# Altium schematic sheet Reed_Switch.SchDoc
size A4; SheetNumber: 5
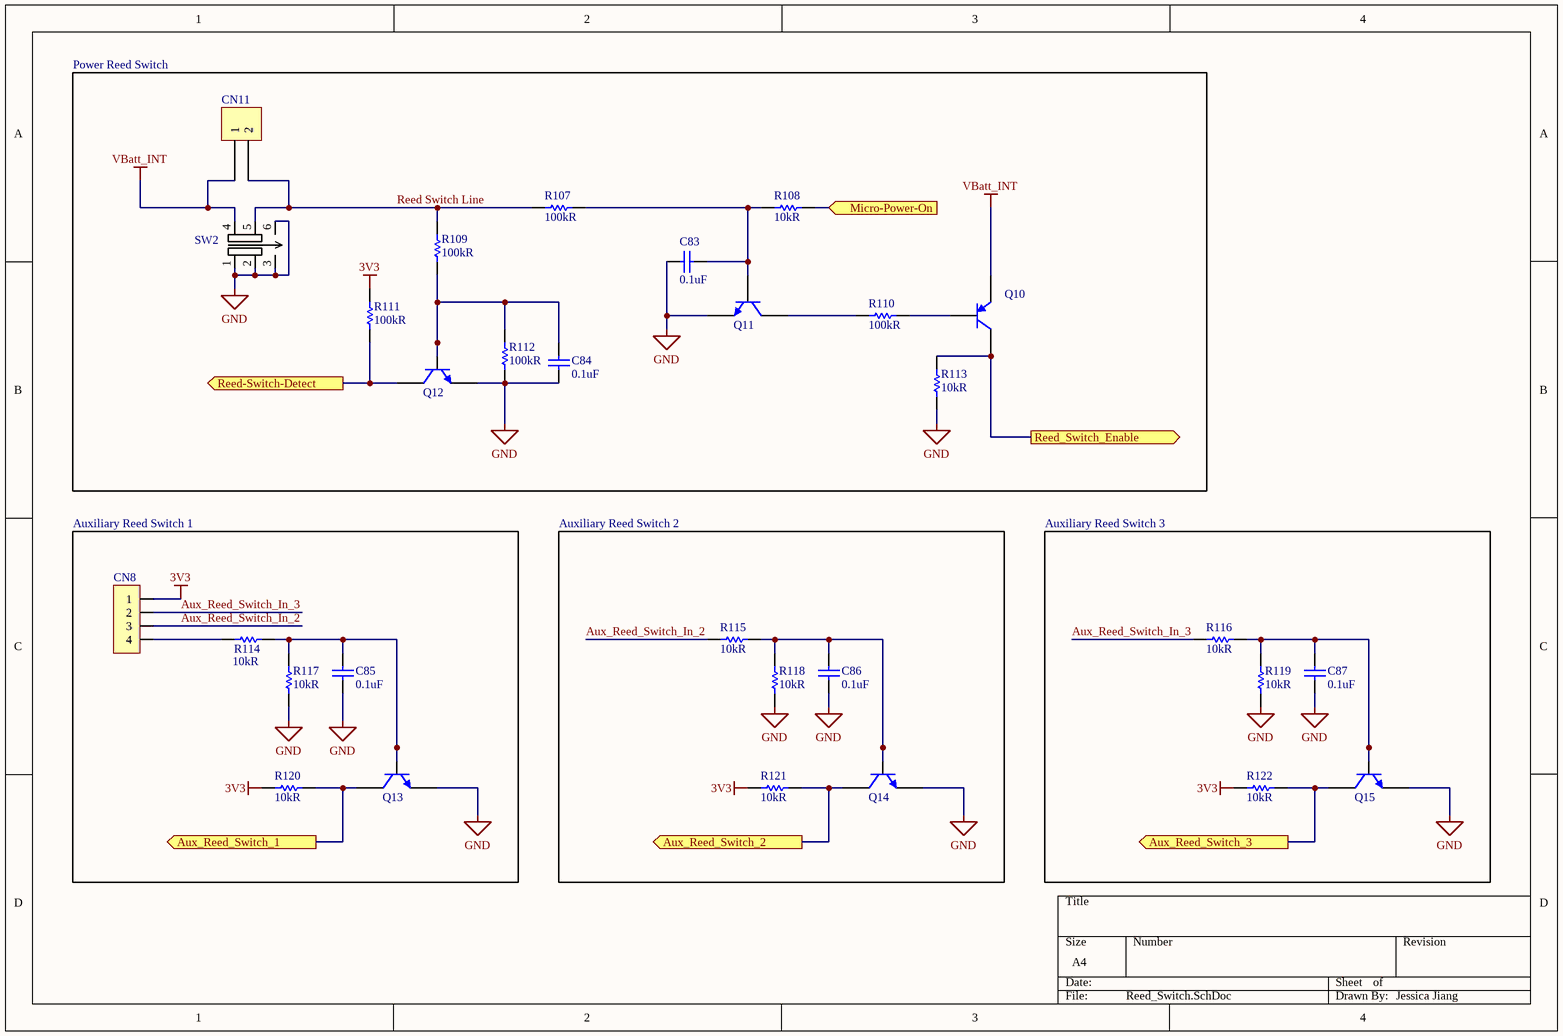
[diagram p0: Reed_Switch.SchDoc]

## Parts
C83  Capacitance: 0.1uF  [FP-CL10-0_1-IPC_A]  (hidden comment: CL10B104JB8NNNC)
C84  Capacitance: 0.1uF  [FP-CL10-0_1-IPC_A]  (hidden comment: CL10B104JB8NNNC)
C85  Capacitance: 0.1uF  [FP-CL10-0_1-IPC_A]  (hidden comment: CL10B104JB8NNNC)
C86  Capacitance: 0.1uF  [FP-CL10-0_1-IPC_A]  (hidden comment: CL10B104JB8NNNC)
C87  Capacitance: 0.1uF  [FP-CL10-0_1-IPC_A]  (hidden comment: CL10B104JB8NNNC)
CN8  Header, Male, 1x4, RA, Pitch 0.1" (2.54mm)  [HEADER, MALE, SHROUDED, 4x1, PITCH 0.1" (2.54mm), RA]  (value not drawn)
CN11  1x2 Shrouded Right Angle  [2X1 Female Header]  (value not drawn)
Q10  BC856A,215  [SOT-23]  (value not drawn)
Q11  BC846B,215  [SOT-23]  (value not drawn)
Q12  BC846B,215  [SOT-23]  (value not drawn)
Q13  BC846B,215  [SOT-23]  (value not drawn)
Q14  BC846B,215  [SOT-23]  (value not drawn)
Q15  BC846B,215  [SOT-23]  (value not drawn)
R107  Resistance: 100kR  [RESC1609X50X30ML10T20]  (hidden comment: CRCW0603-100KFKEA)
R108  Resistance: 10kR  [RESC1608X55X25ML10T15]  (hidden comment: RC0603FR-0710KL)
R109  Resistance: 100kR  [RESC1609X50X30ML10T20]  (hidden comment: CRCW0603-100KFKEA)
R110  Resistance: 100kR  [RESC1609X50X30ML10T20]  (hidden comment: CRCW0603-100KFKEA)
R111  Resistance: 100kR  [RESC1609X50X30ML10T20]  (hidden comment: CRCW0603-100KFKEA)
R112  Resistance: 100kR  [RESC1609X50X30ML10T20]  (hidden comment: CRCW0603-100KFKEA)
R113  Resistance: 10kR  [RESC1608X55X25ML10T15]  (hidden comment: RC0603FR-0710KL)
R114  Resistance: 10kR  [RESC1608X55X25ML10T15]  (hidden comment: RC0603FR-0710KL)
R115  Resistance: 10kR  [RESC1608X55X25ML10T15]  (hidden comment: RC0603FR-0710KL)
R116  Resistance: 10kR  [RESC1608X55X25ML10T15]  (hidden comment: RC0603FR-0710KL)
R117  Resistance: 10kR  [RESC1608X55X25ML10T15]  (hidden comment: RC0603FR-0710KL)
R118  Resistance: 10kR  [RESC1608X55X25ML10T15]  (hidden comment: RC0603FR-0710KL)
R119  Resistance: 10kR  [RESC1608X55X25ML10T15]  (hidden comment: RC0603FR-0710KL)
R120  Resistance: 10kR  [RESC1608X55X25ML10T15]  (hidden comment: RC0603FR-0710KL)
R121  Resistance: 10kR  [RESC1608X55X25ML10T15]  (hidden comment: RC0603FR-0710KL)
R122  Resistance: 10kR  [RESC1608X55X25ML10T15]  (hidden comment: RC0603FR-0710KL)
SW2  DPDT, 12V, 200mA, SMT  [CL-2B-22A]  (value not drawn)

## Blocks framed on the sheet
Power Reed Switch: C83 C84 CN11 Q10-Q12 R107-R113 SW2
Auxiliary Reed Switch 1: C85 CN8 Q13 R114 R117 R120
Auxiliary Reed Switch 2: C86 Q14 R115 R118 R121
Auxiliary Reed Switch 3: C87 Q15 R116 R119 R122

## Ports
Aux_Reed_Switch_1 (out), Aux_Reed_Switch_2 (out), Aux_Reed_Switch_3 (out), Micro-Power-On (in), Reed-Switch-Detect (out), Reed_Switch_Enable (out)

## Nets
3V3: CN8.1 R111.2 R120.2 R121.2 R122.1
GND: C83.2 C84.2 C85.2 C86.2 C87.2 Q11.2(E) Q12.2(E) Q13.2(E) Q14.2(E) Q15.2(E) R112.1 R113.2 R117.1 R118.1 R119.2 SW2.1 SW2.2 SW2.3 SW2.6
VBatt_INT: CN11.1 Q10.2(E) SW2.4
Aux_Reed_Switch_1: Q13.3(C) R120.1 ; port Aux_Reed_Switch_1
Aux_Reed_Switch_2: Q14.3(C) R121.1 ; port Aux_Reed_Switch_2
Aux_Reed_Switch_3: Q15.3(C) R122.2 ; port Aux_Reed_Switch_3
Aux_Reed_Switch_In_2: CN8.3 R115.2
Aux_Reed_Switch_In_3: CN8.2 R116.2
Micro-Power-On: R108.2 ; port Micro-Power-On
Reed Switch Line: CN11.2 R107.2 R109.2 SW2.5
Reed-Switch-Detect: Q12.3(C) R111.1 ; port Reed-Switch-Detect
Reed_Switch_Enable: Q10.3(C) R113.1 ; port Reed_Switch_Enable
NetC83_1: C83.1 Q11.1(B) R107.1 R108.1
NetC84_1: C84.1 Q12.1(B) R109.1 R112.2
NetC85_1: C85.1 Q13.1(B) R114.1 R117.2
NetC86_1: C86.1 Q14.1(B) R115.1 R118.2
NetC87_1: C87.1 Q15.1(B) R116.1 R119.1
NetCN8_4: CN8.4 R114.2
NetQ10_1: Q10.1(B) R110.2
NetQ11_3: Q11.3(C) R110.1

## Notes on the sheet
- Jessica Jiang

## Library data of the parts
C83-C87 = CMP-00000-4: CAP CER 0.1UF 50V X7R 0603; Tolerance: 5%; Material: Ceramic; Case Code (Imperial): 0603; Mount: Surface Mount; Thickness: 0.035inch; Depth: 0.8mm; Packaging: Tape and Reel; Package Quantity: 1; Dielectric: X7R; Height: 0.8mm; Voltage: 50V; Radiation Hardening: No; Max Operating Temperature: 125°C; Voltage Rating: 50V; Case/Package: 0603; Min Operating Temperature: -55°C; Case Code (Metric): 1608; Length: 1.6mm; Contact Plating: Tin; Width: 0.031inch
CN8 = CMP-005-0029-3: Connector Header Through Hole, Right Angle 4 position 0.100" (2.54mm); Source: AUVic_Schematic_Library_Connectors.SchLib; Created On: 2020-05-20; Pin Count: 4; Component Type: Standard; Design Item ID: Header, Male, 1x4, RA, Pitch 0.1" (2.54mm); Created By: Miguel Manguerra
CN11 = CMP-00010-3: 02 MTE HDR SRRA LATCH; PCB Mount Retention: Without; Number of Positions: 2; Row Spacing: 0.1inch; Contact Retention: Yes (With); PCB Mount Alignment: No (Without); Current Rating: 3A; PCB Thickness: 0.062inch; Insulation Resistance: 5GR; Gender: Male; Connector Type: Plug,Header,Pin; Tail Length: 3.3mm; Approvals: CSA; Pitch: 2.54mm; Contact Resistance: 15mR; Color: Black; REACH SVHC: Unknown; Contact Shape: Square; Number of Contacts: 2; PCB Mounting Orientation: Right Angle; Housing Material: Thermoplastic; Max Operating Temperature: 105°C; Mount: Through Hole; Package Quantity: 68; Contact Current Rating: 3A; Housing Color: Black; Contact Material: Brass; Min Operating Temperature: -65°C; Packaging: Rail/Tube; Height: 13.59mm; ELV: Compliant; Number of Rows: 1; Orientation: Right Angle; Lead Free: Lead Free; Mating Retention: Yes (With); Strain Relief: No (Without); Length: 7.62mm; Flammability Rating: UL94 V-0; Contact Plating: Gold,Tin,Matte; Contact Mating Length: 0.23inch; Contact Gender: Male; Termination: Crimp; Backwall/Post Interruptions: No (Without); Depth: 13.59mm; Mating Alignment: Yes (With)
Q10 = CMP-052-0003-1: PNP 65V 100mA 250mW; Published: 8-Jun-2000; LatestRevisionDate: 15-Jan-2003; Component Type: Standard; Pin Count: 3; Source: AUVic_Schematic_Library_Transistors.SchLib; Design Item ID: BC856A,215
Q11-Q15 = CMP-052-0002-1: NPN 65V 100mA 250mW; Published: 8-Jun-2000; LatestRevisionDate: 09-Sep-2016; DatasheetVersion: 1997; Publisher: Andy Bates; Pin Count: 3; Component Type: Standard; Source: AUVic_Schematic_Library_Transistors.SchLib; Design Item ID: BC846B,215
R107 R109-R112 = CMP-00036-2: Resistor; Thick Film; 100 Kilohms; 0.1 W; 1%; SMT; 0603; TCR 37 ppm/DegC; Tape and Reel; Voltage Rating: 75V; Temperature Coefficient: 100ppm/°C; Power Rating: 100mW; Number of Terminations: 2; Number of Pins: 2; Contact Plating: Tin,Lead; Lead Free: Lead Free; Voltage Rating (DC): 75V; Package Quantity: 10; REACH SVHC: Unknown; Min Operating Temperature: -55°C; Height: 0.45mm; Composition: Thick Film; Case Code (Metric): 1608; Weight: 7.1E-05oz; Depth: 0.85mm; Features: Automotive AEC-Q200; Military Standard: Not; Tolerance: 1%; Radiation Hardening: No; Max Power Dissipation: 100mW; Case Code (Imperial): 0603; Max Operating Temperature: 155°C; Packaging: Tape and Reel; Width: 0.033inch; Case/Package: 0603; Termination: SMD/SMT; Length: 1.55mm
R108 R113-R122 = CMP-00037-2: Res General Purpose Thick Film 0603 10K Ohm 1% 1/10W ±100ppm/°C Molded SMD Paper T/R; Power Rating: 100mW; Voltage Rating (DC): 50V; Voltage Rating: 75V; Case/Package: 0603; Weight: 7.1E-05oz; Case Code (Imperial): 0603; Composition: Thick Film; Depth: 0.8mm; Min Operating Temperature: -55°C; Width: 0.8mm; Height: 0.45mm; Military Standard: Not; Packaging: Tape and Reel; Termination: SMD/SMT; Lead Free: Lead Free; Temperature Coefficient: 100ppm/°C; Number of Pins: 2; Max Operating Temperature: 155°C; Lead Pitch: 0.3mm; REACH SVHC: No SVHC; Case Code (Metric): 1608; Tolerance: 1%; Length: 1.6mm
SW2 = CMP-050-0002-2: Design Item ID: DPDT, 12V, 200mA, SMT; Source: AUVic_Integrated_Library_Switches.SchLib; Date Created: 2017-09-20; Pin Count: 6; Created By: Lyden Smith; Component Type: Standard